# Altium schematic sheet Ethernet_Networking.SchDoc
size B; DocumentNumber: 1; SheetNumber: 1; SheetTotal: 1
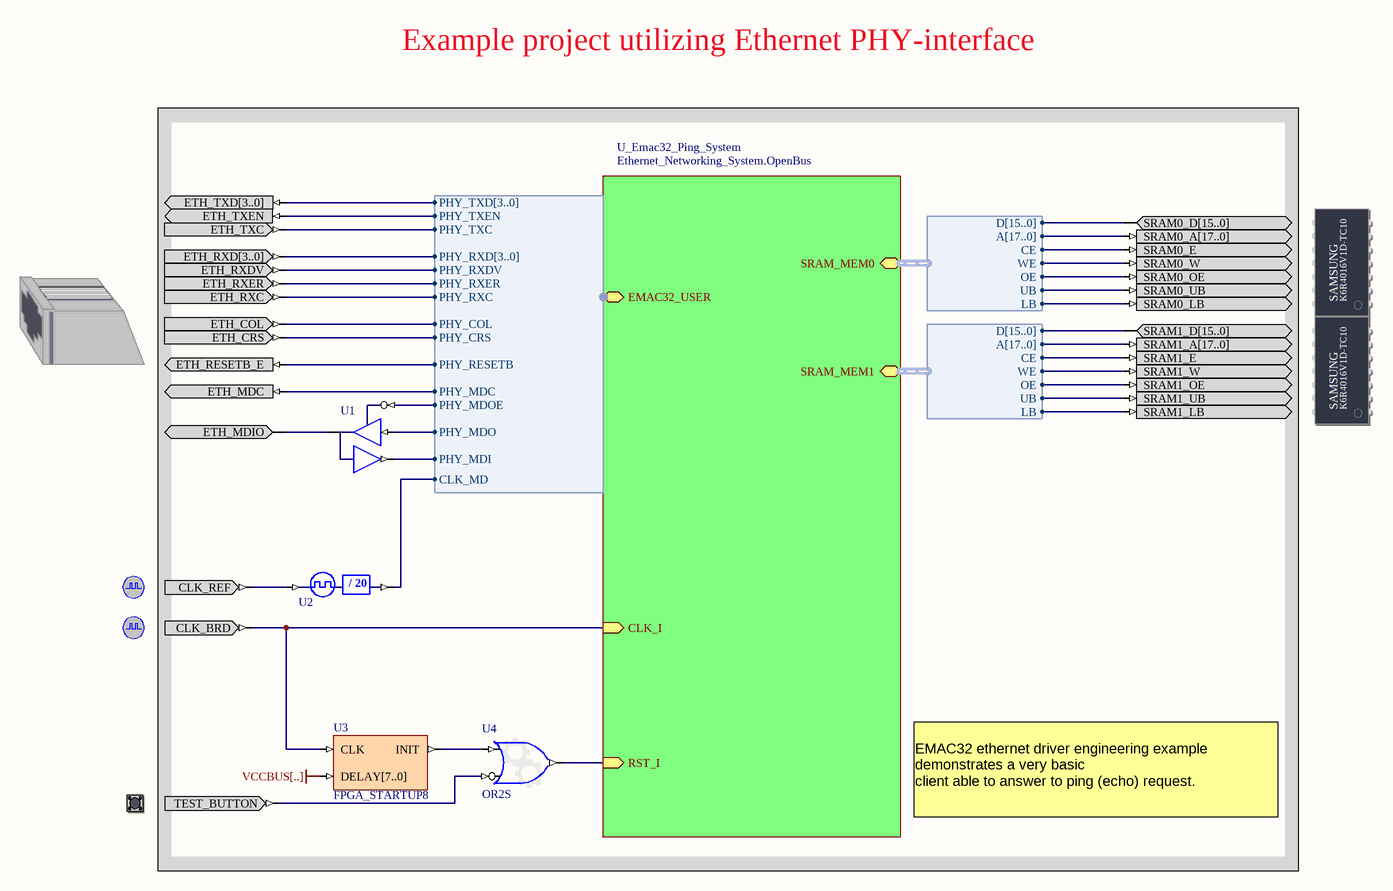
[diagram p0: Ethernet_Networking.SchDoc]

## Parts
(Parts that share a designator on the sheet are numbered #1, #2 ... from top to bottom, then left to right.)
?#1  ETH_PHY  (value not drawn)
?#2  SRAM_DAUGHTER0  (value not drawn)
?#3  SRAM_DAUGHTER1  (value not drawn)
?#4  CLOCK_REFERENCE  (value not drawn)
?#5  CLOCK_BOARD  (value not drawn)
?#6  TEST_BUTTON  (value not drawn)
U1  IOBUF  (value not drawn)
U2  CDIV20DC50  (value not drawn)
U3  FPGA_STARTUP8
U4  OR2S

## Sub-sheets
U_Emac32_Ping_System = Ethernet_Networking_System.OpenBus: RST_I (in), CLK_I (in), SRAM_MEM0 (harness WB_MEM_CTRL_SRAM16_A18), SRAM_MEM1 (harness WB_MEM_CTRL_SRAM16_A18), EMAC32_USER (harness EMAC32)

## Harnesses
WB_MEM_CTRL_SRAM16_A18: D[15..0], A[17..0], CE, WE, OE, UB, LB
EMAC32: PHY_TXD[3..0], PHY_TXEN, PHY_TXC, PHY_RXD[3..0], PHY_RXDV, PHY_RXER, PHY_RXC, PHY_COL, PHY_CRS, PHY_RESETB, PHY_MDC, PHY_MDOE, PHY_MDO, PHY_MDI, CLK_MD

## Nets
VCCBUS[..]: U3.DELAY[7..0]
Net?#1_ETH_COL: ?#1.ETH_COL ; sheet U_Emac32_Ping_System/EMAC32_USER.PHY_COL
Net?#1_ETH_CRS: ?#1.ETH_CRS ; sheet U_Emac32_Ping_System/EMAC32_USER.PHY_CRS
Net?#1_ETH_MDC: ?#1.ETH_MDC ; sheet U_Emac32_Ping_System/EMAC32_USER.PHY_MDC
Net?#1_ETH_MDIO: ?#1.ETH_MDIO U1.IO
Net?#1_ETH_RESETB_E: ?#1.ETH_RESETB_E ; sheet U_Emac32_Ping_System/EMAC32_USER.PHY_RESETB
Net?#1_ETH_RXC: ?#1.ETH_RXC ; sheet U_Emac32_Ping_System/EMAC32_USER.PHY_RXC
Net?#1_ETH_RXD[3..0]: ?#1.ETH_RXD[3..0] ; sheet U_Emac32_Ping_System/EMAC32_USER.PHY_RXD[3..0]
Net?#1_ETH_RXDV: ?#1.ETH_RXDV ; sheet U_Emac32_Ping_System/EMAC32_USER.PHY_RXDV
Net?#1_ETH_RXER: ?#1.ETH_RXER ; sheet U_Emac32_Ping_System/EMAC32_USER.PHY_RXER
Net?#1_ETH_TXC: ?#1.ETH_TXC ; sheet U_Emac32_Ping_System/EMAC32_USER.PHY_TXC
Net?#1_ETH_TXD[3..0]: ?#1.ETH_TXD[3..0] ; sheet U_Emac32_Ping_System/EMAC32_USER.PHY_TXD[3..0]
Net?#1_ETH_TXEN: ?#1.ETH_TXEN ; sheet U_Emac32_Ping_System/EMAC32_USER.PHY_TXEN
Net?#2_SRAM0_A[17..0]: ?#2.SRAM0_A[17..0] ; sheet U_Emac32_Ping_System/SRAM_MEM0.A[17..0]
Net?#2_SRAM0_D[15..0]: ?#2.SRAM0_D[15..0] ; sheet U_Emac32_Ping_System/SRAM_MEM0.D[15..0]
Net?#2_SRAM0_E: ?#2.SRAM0_E ; sheet U_Emac32_Ping_System/SRAM_MEM0.CE
Net?#2_SRAM0_LB: ?#2.SRAM0_LB ; sheet U_Emac32_Ping_System/SRAM_MEM0.LB
Net?#2_SRAM0_OE: ?#2.SRAM0_OE ; sheet U_Emac32_Ping_System/SRAM_MEM0.OE
Net?#2_SRAM0_UB: ?#2.SRAM0_UB ; sheet U_Emac32_Ping_System/SRAM_MEM0.UB
Net?#2_SRAM0_W: ?#2.SRAM0_W ; sheet U_Emac32_Ping_System/SRAM_MEM0.WE
Net?#3_SRAM1_A[17..0]: ?#3.SRAM1_A[17..0] ; sheet U_Emac32_Ping_System/SRAM_MEM1.A[17..0]
Net?#3_SRAM1_D[15..0]: ?#3.SRAM1_D[15..0] ; sheet U_Emac32_Ping_System/SRAM_MEM1.D[15..0]
Net?#3_SRAM1_E: ?#3.SRAM1_E ; sheet U_Emac32_Ping_System/SRAM_MEM1.CE
Net?#3_SRAM1_LB: ?#3.SRAM1_LB ; sheet U_Emac32_Ping_System/SRAM_MEM1.LB
Net?#3_SRAM1_OE: ?#3.SRAM1_OE ; sheet U_Emac32_Ping_System/SRAM_MEM1.OE
Net?#3_SRAM1_UB: ?#3.SRAM1_UB ; sheet U_Emac32_Ping_System/SRAM_MEM1.UB
Net?#3_SRAM1_W: ?#3.SRAM1_W ; sheet U_Emac32_Ping_System/SRAM_MEM1.WE
Net?#4_CLK_REF: ?#4.CLK_REF U2.CLKIN
Net?#5_CLK_BRD: ?#5.CLK_BRD U3.CLK ; sheet U_Emac32_Ping_System/CLK_I
Net?#6_TEST_BUTTON: ?#6.TEST_BUTTON U4.I1
NetU1_I: U1.I ; sheet U_Emac32_Ping_System/EMAC32_USER.PHY_MDO
NetU1_O: U1.O ; sheet U_Emac32_Ping_System/EMAC32_USER.PHY_MDI
NetU1_T: U1.T ; sheet U_Emac32_Ping_System/EMAC32_USER.PHY_MDOE
NetU2_CLKDV: U2.CLKDV ; sheet U_Emac32_Ping_System/EMAC32_USER.CLK_MD
NetU3_INIT: U3.INIT U4.I0
NetU4_O: U4.O ; sheet U_Emac32_Ping_System/RST_I

## Notes on the sheet
- Example project utilizing Ethernet PHY-interface
- EMAC32 ethernet driver engineering example demonstrates a very basic
  client able to answer to ping (echo) request.
- Title
- Size:
- Date:
- B
- Number:
- Time:
- Revision:
- Sheet
- of
- File:
- (in symbol CDIV20DC50) / 20
- (in symbol SRAM_DAUGHTER0) SAMSUNG; K6R4016V1D-TC10
- (in symbol SRAM_DAUGHTER1) SAMSUNG; K6R4016V1D-TC10

## Library data of the parts
?#1 = ETH_PHY: Ethernet PHY-interface; PortComponent: True; Published: 22-Jan-2007; Publisher: Altium Limited; HelpURL: TR0147 Technical Reference for Altium's USB-IrDA-Ethernet Peripheral Board PB03.pdf#page=7
?#2 = SRAM_DAUGHTER0: Free Static RAM - Daughterboard; PortComponent: True; Published: 14-May-2007; Publisher: Altium Limited; HelpURL: TR0149 Technical Reference for Altium's Xilinx Spartan-3 Daughter Board DB30.pdf#page=16
?#3 = SRAM_DAUGHTER1: Free Static RAM - Daughterboard; PortComponent: True; Published: 14-May-2007; Publisher: Altium Limited; HelpURL: TR0149 Technical Reference for Altium's Xilinx Spartan-3 Daughter Board DB30.pdf#page=16
?#4 = CLOCK_REFERENCE: Global System Clock Reference Supply; PortComponent: True; Published: 19-Nov-2003; Publisher: Altium Limited; HelpURL: TR0143 Technical Reference Manual for Altium's Desktop NanoBoard NB2DSK01.pdf#page=41
?#5 = CLOCK_BOARD: Global System Clock Supply; PortComponent: True; Published: 19-Nov-2003; Publisher: Altium Limited; HelpURL: TR0143 Technical Reference Manual for Altium's Desktop NanoBoard NB2DSK01.pdf#page=41; UseInDSF: True
?#6 = TEST_BUTTON: Test / Reset Button; PortComponent: True; Published: 19-Nov-2003; Publisher: Altium Limited; HelpURL: TR0143 Technical Reference Manual for Altium's Desktop NanoBoard NB2DSK01.pdf#page=53
U1 = iobuf: Input/Output Buffer; Enable: Low; Control: Common Control T; ArchiveName: GENERIC; VHDLIB_SIM: GENERIC_LIB; Published: 29-Jan-2004; Publisher: Altium Limited; XilinxEquivalent: IOBUF; LastRevisionNo: 1.00.00; HelpURL: CR0118 FPGA Generic Library Guide.pdf#page=293; ComponentLink1URL: CR0125 FPGA Buffer Resource Usage.pdf#page=78; ComponentLink1Description: Core &Resource Usage; FunctionalClass: Buffer; SubClass: IOBUF
U2 = CDIV20DC50: Clock Divider by 20 with 50% Duty Cycle Output; DivisorRate: 20; DutyCycle: 50; ArchiveName: GENERIC; VHDLIB_SIM: GENERIC_LIB; Published: 29-Jan-2004; Publisher: Altium Limited; LastRevisionNo: 1.00.00; HelpURL: CR0118 FPGA Generic Library Guide.pdf#page=143; ComponentLink1URL: CR0127 FPGA Clock Divider Resource Usage.pdf#page=21; ComponentLink1Description: Core &Resource Usage; FunctionalClass: Clock Divider
U3 = FPGA_STARTUP8: FPGA Startup With 8 Bit Delay; Published: 9-Dec-2004; Publisher: Altium Limited; HelpURL: CR0119 FPGA_STARTUPx Powerup Delay Unit.pdf; LastRevisionNo: 1.00.00; ComponentLink1Description: Core &Resource Usage; ComponentLink1URL: CR0139 FPGA Peripheral Resource Usage.pdf#page=11
U4 = GATE: Configurable Generic Gate; ConfiguratorName: GENERIC_GATE; ConfigurationParameters: {}Version[1.0]{}GateKind[OR]{}BusInput[False]{}GateInputType[Bit]{}GateOutputOption[Normal]{}BusWidth[8]{}RegisterOutputs[False]{}NegativeClockEdge[False]{}InputCount[2]{}InputInvert0[False]{}InputInvert1[True]{}; LastRevisionNo: 1.00.00; Published: 3-Sep-2008; Publisher: Altium Limited